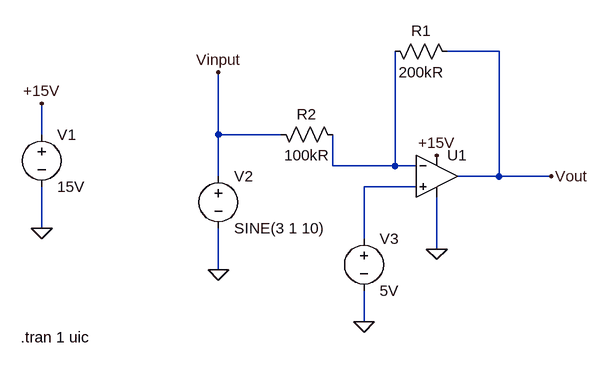
[diagram p0: schematic opamp circuit.asc]
opamp circuit.asc, the LTspice schematic file:
Version 4.1
SHEET 1 880 680
WIRE 368 -32 288 -32
WIRE -336 96 -336 48
WIRE -64 96 -64 0
WIRE 32 96 -64 96
WIRE 112 144 112 96
WIRE 208 144 208 -32
WIRE 208 144 112 144
WIRE 240 144 208 144
WIRE -64 160 -64 96
WIRE 368 160 368 -32
WIRE 368 160 304 160
WIRE 448 160 368 160
WIRE 240 176 160 176
WIRE -336 240 -336 176
WIRE 160 256 160 176
WIRE 272 272 272 192
WIRE -64 304 -64 240
WIRE 160 384 160 336
FLAG -336 240 0
FLAG -64 304 0
FLAG 160 384 0
FLAG 272 272 0
FLAG -336 48 +15V
FLAG 448 160 Vout
FLAG -64 0 Vinput
FLAG 272 128 +15V
SYMBOL OpAmps\\UniversalOpAmp2 272 160 R0
SYMATTR InstName U1
SYMBOL voltage -336 80 R0
WINDOW 123 0 0 Left 0
WINDOW 39 0 0 Left 0
SYMATTR InstName V1
SYMATTR Value 15V
SYMBOL voltage -64 144 R0
WINDOW 123 0 0 Left 0
WINDOW 39 0 0 Left 0
SYMATTR InstName V2
SYMATTR Value SINE(3 1 10)
SYMBOL voltage 160 240 R0
WINDOW 123 0 0 Left 0
WINDOW 39 0 0 Left 0
SYMATTR InstName V3
SYMATTR Value 5V
SYMBOL res 192 -48 M90
WINDOW 0 0 56 VBottom 2
WINDOW 3 32 56 VTop 2
SYMATTR InstName R1
SYMATTR Value 200kR
SYMBOL res 16 80 M90
WINDOW 0 0 56 VBottom 2
WINDOW 3 32 56 VTop 2
SYMATTR InstName R2
SYMATTR Value 100kR
TEXT -368 408 Left 2 !.tran 1 uic

The netlist it stands for:
* opamp circuit.asc
X§U1 N002 N001 +15V 0 Vout level2 Avol=1Meg GBW=10Meg Slew=10Meg Ilimit=25m Rail=0 Vos=0 En=0 Enk=0 In=0 Ink=0 Rin=500Meg  ; pins In+ In- V+ V- OUT
V1 +15V 0 15V
V2 Vinput 0 SINE(3 1 10)
V3 N002 0 5V
R1 N001 Vout 200kR
R2 Vinput N001 100kR
.tran 1 uic
.lib UniversalOpAmp2.lib
.backanno
.end